# Altium schematic sheet Sheet1.SchDoc
size D
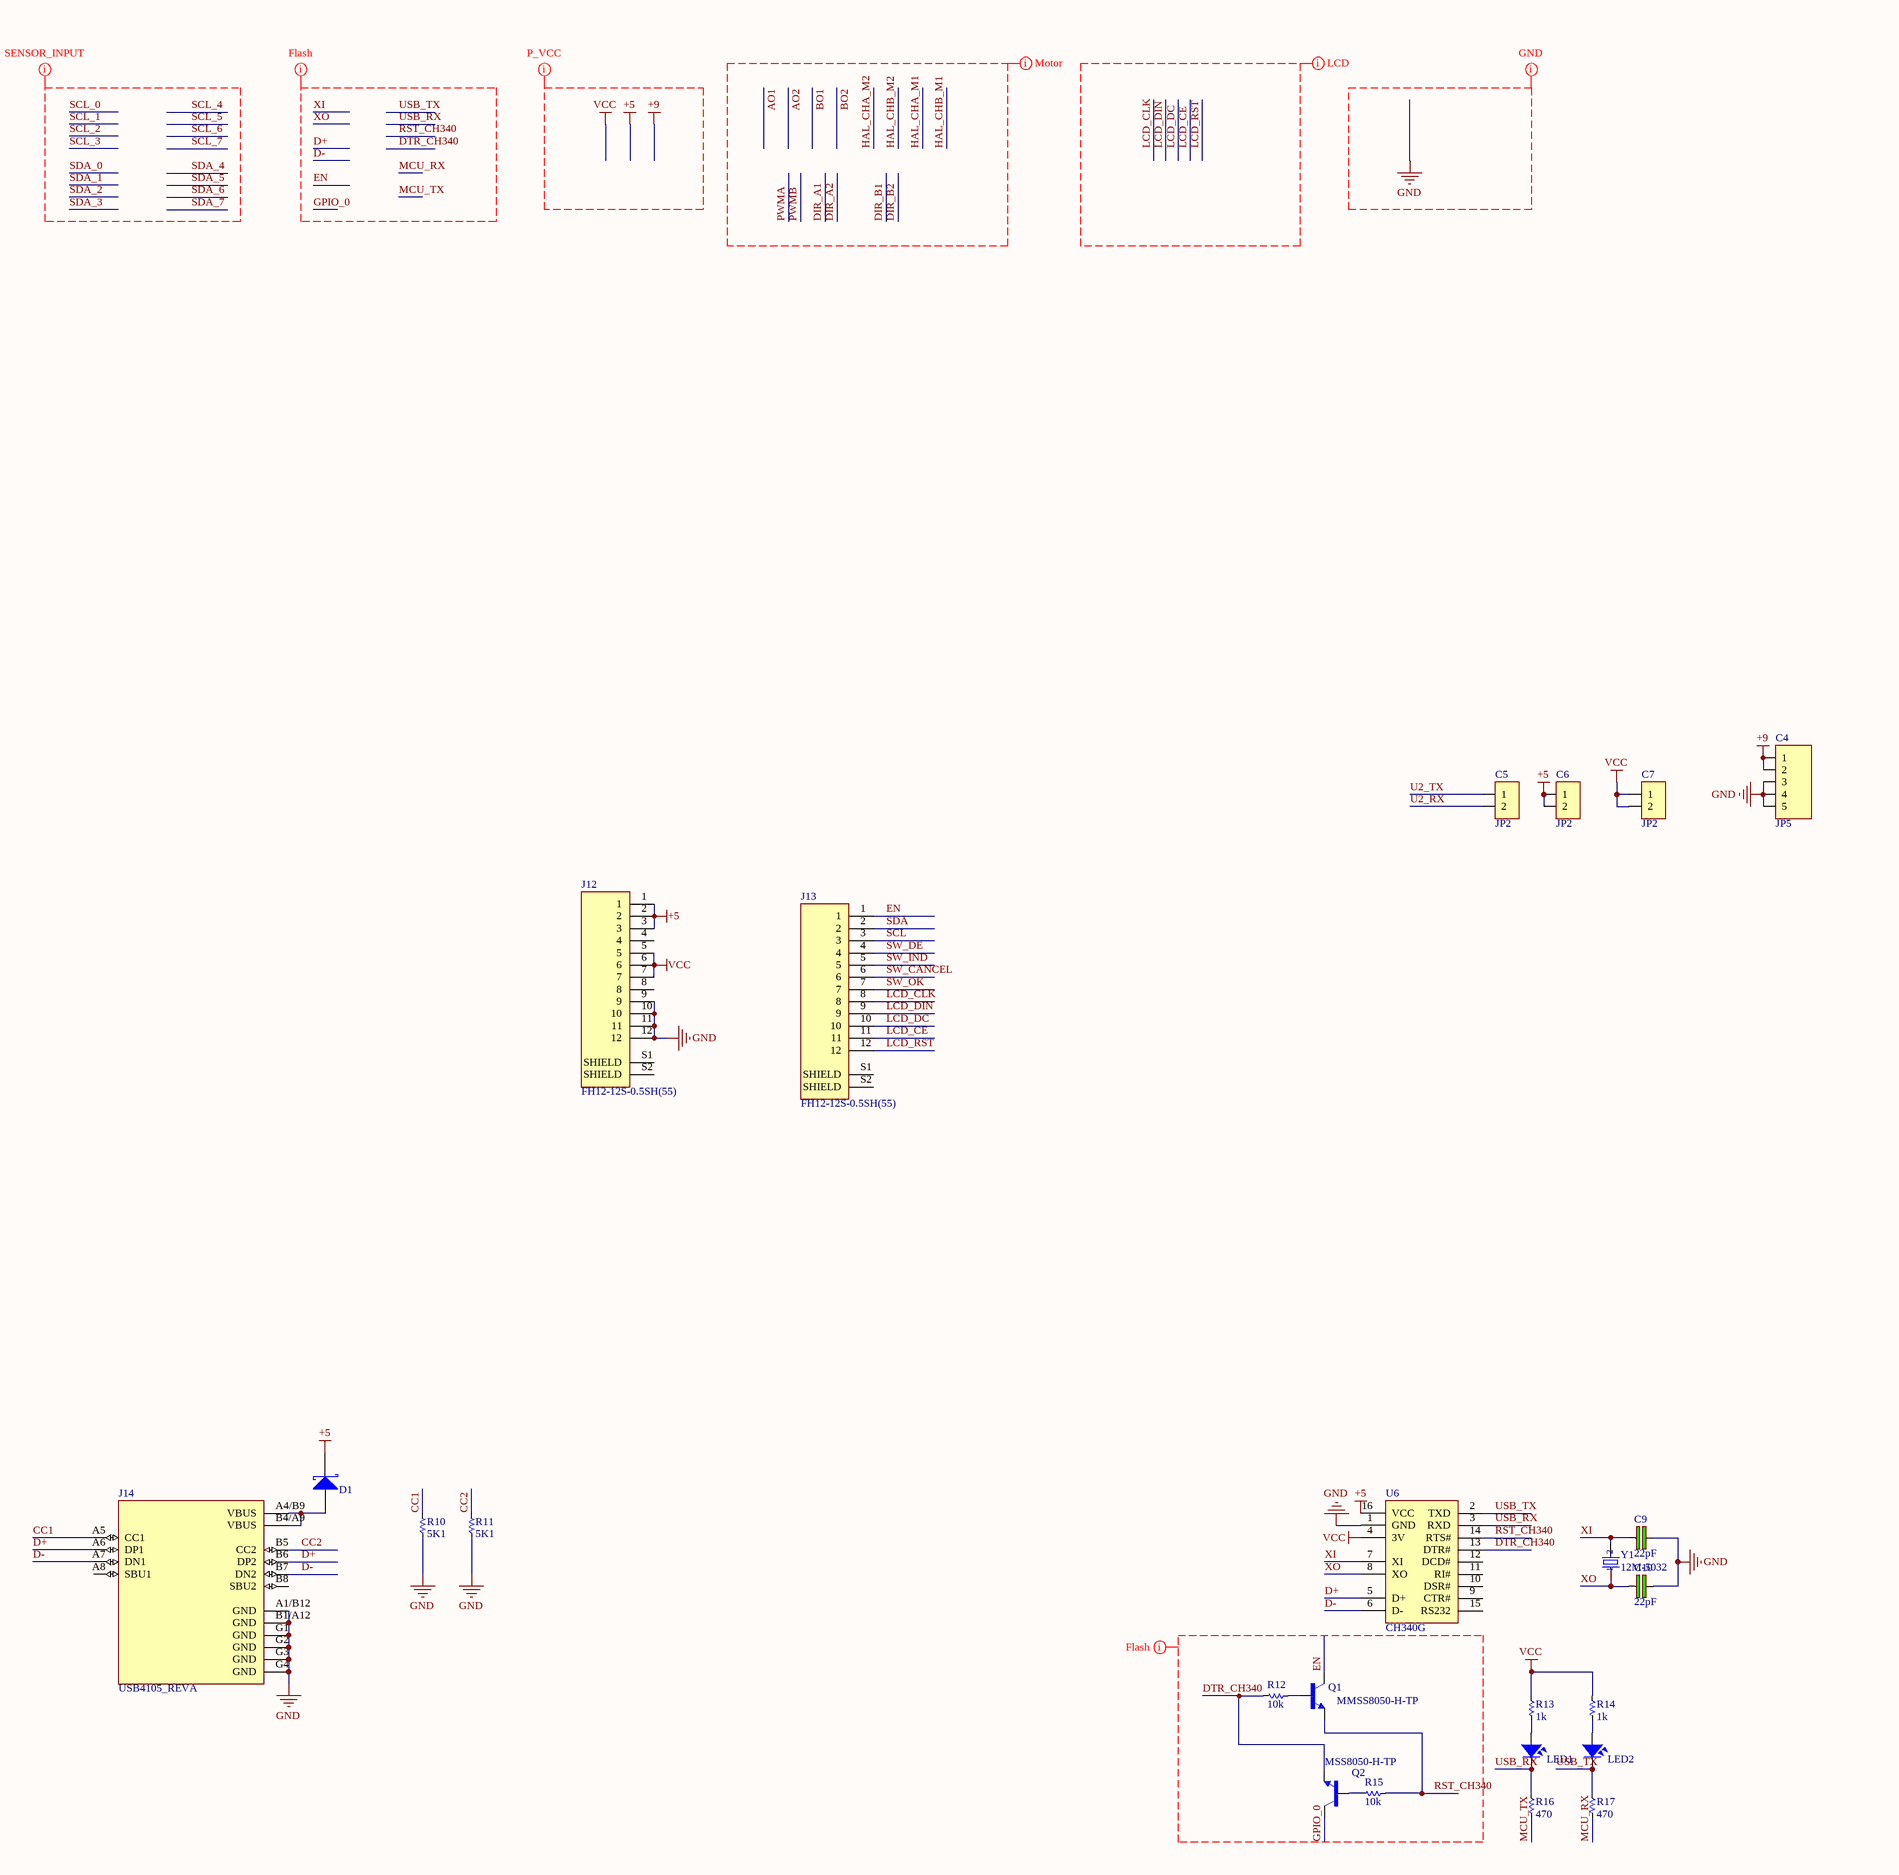
[diagram p0: Sheet1.SchDoc, left]
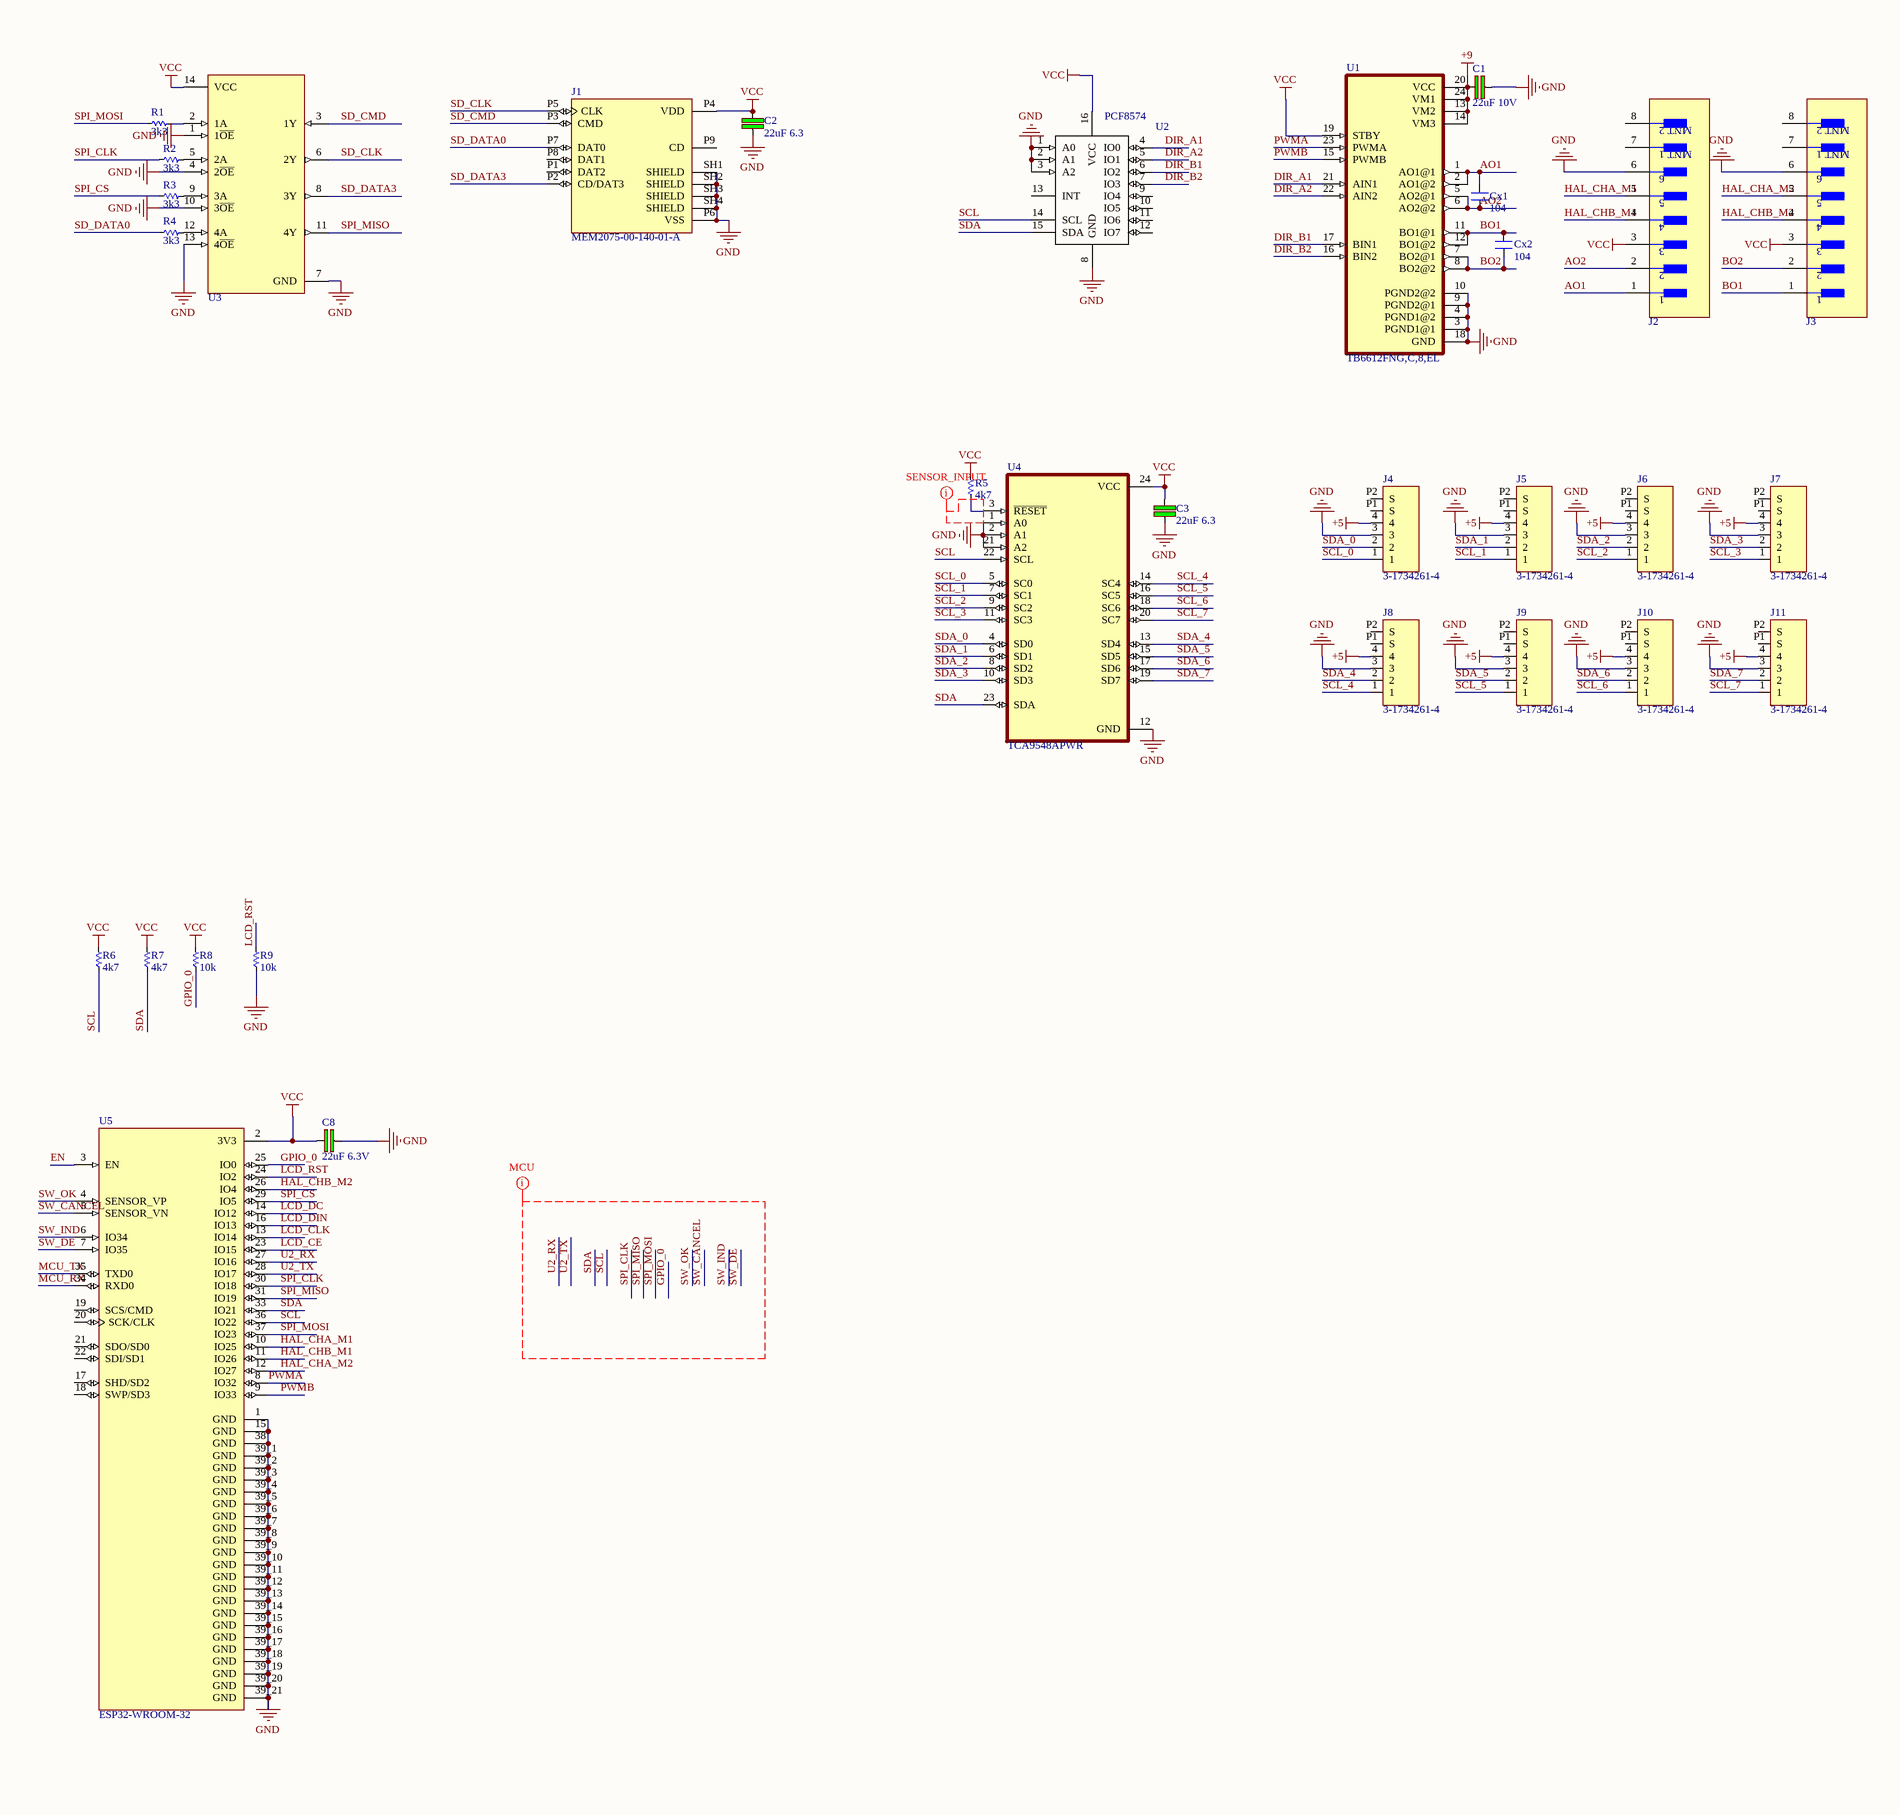
[diagram p1: Sheet1.SchDoc, right]

## Parts
C1  22uF 10V  [CN-SMD-1206]
C2  22uF 6.3  [CN-SMD-1206]
C3  22uF 6.3  [CN-SMD-1206]
C4  JP5  [JP5-D1T]
C5  JP2  [JP2-D1T]
C6  JP2  [JP2-D1T]
C7  JP2  [JP2-D1T]
C8  22uF 6.3V  [CN-SMD-1206]
C9  22pF  [CN-SMD-0603]
C10  22pF  [CN-SMD-0603]
Cx1  104  [CN-SMD-0603]
Cx2  104  [CN-SMD-0603]
D1  D Schottky  [SS34]  (value not drawn)
J1  MEM2075-00-140-01-A  [GCT_MEM2075-00-140-01-A]
J2  532610671  [Molex_0_MFG]  (value not drawn)
J3  532610671  [Molex_0_MFG]  (value not drawn)
J4  3-1734261-4  [TE_3-1734261-4]
J5  3-1734261-4  [TE_3-1734261-4]
J6  3-1734261-4  [TE_3-1734261-4]
J7  3-1734261-4  [TE_3-1734261-4]
J8  3-1734261-4  [TE_3-1734261-4]
J9  3-1734261-4  [TE_3-1734261-4]
J10  3-1734261-4  [TE_3-1734261-4]
J11  3-1734261-4  [TE_3-1734261-4]
J12  FH12-12S-0.5SH(55)  [HIROSE_FH12-12S-0.5SH(55)]
J13  FH12-12S-0.5SH(55)  [HIROSE_FH12-12S-0.5SH(55)]
J14  USB4105_REVA  [GCT_USB4105_REVA]
LED1  LED  [LED-0805-Red]  (value not drawn)
LED2  LED  [LED-0805-Red]  (value not drawn)
Q1  MMSS8050-H-TP  [TRANS_MMSS8050-H-TP]
Q2  MSS8050-H-TP  [TRANS_MMSS8050-H-TP]
R1  3k3  [RES-SMD-0603]
R2  3k3  [RES-SMD-0603]
R3  3k3  [RES-SMD-0603]
R4  3k3  [RES-SMD-0603]
R5  4k7  [RES-SMD-0603]
R6  4k7  [RES-SMD-0603]
R7  4k7  [RES-SMD-0603]
R8  10k  [RES-SMD-0603]
R9  10k  [RES-SMD-0603]
R10  5K1  [RES-SMD-0603]
R11  5K1  [RES-SMD-0603]
R12  10k  [RES-SMD-0603]
R13  1k  [RES-SMD-0603]
R14  1k  [RES-SMD-0603]
R15  10k  [RES-SMD-0603]
R16  470  [RES-SMD-0603]
R17  470  [RES-SMD-0603]
U1  TB6612FNG,C,8,EL  [SOP65P760X160-24N]
U2  PCF8574  [SO16L]
U3  SN74HC125PWR  [Texas_Instruments_PW0014A_MFG]  (value not drawn)
U4  TCA9548APWR  [SOP65P640X120-24N]
U5  ESP32-WROOM-32  [MODULE_ESP32-WROOM-32]
U6  CH340G  [SO16]
Y1  12M-5032  [X2-SMD-5.0X3.2X1.3MM]

## Nets
+5: C6.1 C6.2 D1.2(K) J4.4 J5.4 J6.4 J7.4 J8.4 J9.4 J10.4 J11.4 J12.1 J12.2 J12.3 U6.16(VCC)
+9: C1.2 C4.1 C4.2 U1.13(VM2) U1.14(VM3) U1.20(VCC) U1.24(VM1)
GND: C1.1 C2.1 C3.1 C4.3 C4.4 C4.5 C8.1 C9.2 C10.2 J1.P6(VSS) J1.SH1(SHIELD) J1.SH2(SHIELD) J1.SH3(SHIELD) J1.SH4(SHIELD) J2.6 J3.6 J4.3 J5.3 J6.3 J7.3 J8.3 J9.3 J10.3 J11.3 J12.9 J12.10 J12.11 J12.12 J14.A1/B12(GND) J14.B1/A12(GND) J14.G1(GND) J14.G2(GND) J14.G3(GND) J14.G4(GND) R9.1 R10.1 R11.1 U1.3(PGND1@1) U1.4(PGND1@2) U1.9(PGND2@1) U1.10(PGND2@2) U1.18(GND) U2.1(A0) U2.2(A1) U2.3(A2) U2.8(GND) U3.1(1~{OE}) U3.4(2~{OE}) U3.7(GND) U3.10(3~{OE}) U3.13(4~{OE}) U4.1(A0) U4.2(A1) U4.12(GND) U4.21(A2) U5.1(GND) U5.15(GND) U5.38(GND) U5.39_1(GND) U5.39_2(GND) U5.39_3(GND) U5.39_4(GND) U5.39_5(GND) U5.39_6(GND) U5.39_7(GND) U5.39_8(GND) U5.39_9(GND) U5.39_10(GND) U5.39_11(GND) U5.39_12(GND) U5.39_13(GND) U5.39_14(GND) U5.39_15(GND) U5.39_16(GND) U5.39_17(GND) U5.39_18(GND) U5.39_19(GND) U5.39_20(GND) U5.39_21(GND) U6.1(GND)
VCC: C2.2 C3.2 C7.1 C7.2 C8.2 J1.P4(VDD) J2.3 J3.3 J12.5 J12.6 J12.7 R5.2 R6.2 R7.2 R8.2 R13.2 R14.2 U1.19(STBY) U2.16(VCC) U3.14(VCC) U4.24(VCC) U5.2(3V3) U6.4(3V)
AO1: Cx1.2 J2.1 U1.1(AO1@1) U1.2(AO1@2)
AO2: Cx1.1 J2.2 U1.5(AO2@1) U1.6(AO2@2)
BO1: Cx2.2 J3.1 U1.11(BO1@1) U1.12(BO1@2)
BO2: Cx2.1 J3.2 U1.7(BO2@1) U1.8(BO2@2)
CC1: J14.A5(CC1) R10.2
CC2: J14.B5(CC2) R11.2
D+: J14.A6(DP1) J14.B6(DP2) U6.5(D+)
D-: J14.A7(DN1) J14.B7(DN2) U6.6(D-)
DIR_A1: U1.21(AIN1) U2.4(IO0)
DIR_A2: U1.22(AIN2) U2.5(IO1)
DIR_B1: U1.17(BIN1) U2.6(IO2)
DIR_B2: U1.16(BIN2) U2.7(IO3)
DTR_CH340: Q2.2(E) R12.1 U6.13(DTR#)
EN: J13.1 Q1.3(C) U5.3(EN)
GPIO_0: Q2.3(C) R8.1 U5.25(IO0)
HAL_CHA_M1: J2.5 U5.10(IO25)
HAL_CHA_M2: J3.5 U5.12(IO27)
HAL_CHB_M1: J2.4 U5.11(IO26)
HAL_CHB_M2: J3.4 U5.26(IO4)
LCD_CE: J13.11 U5.23(IO15)
LCD_CLK: J13.8 U5.13(IO14)
LCD_DC: J13.10 U5.14(IO12)
LCD_DIN: J13.9 U5.16(IO13)
LCD_RST: J13.12 R9.2 U5.24(IO2)
MCU_RX: R17.1 U5.34(RXD0)
MCU_TX: R16.1 U5.35(TXD0)
PWMA: U1.23(PWMA) U5.8(IO32)
PWMB: U1.15(PWMB) U5.9(IO33)
RST_CH340: Q1.2(E) R15.2 U6.14(RTS#)
SCL: J13.3 R6.1 U2.14(SCL) U4.22(SCL) U5.36(IO22)
SCL_0: J4.1 U4.5(SC0)
SCL_1: J5.1 U4.7(SC1)
SCL_2: J6.1 U4.9(SC2)
SCL_3: J7.1 U4.11(SC3)
SCL_4: J8.1 U4.14(SC4)
SCL_5: J9.1 U4.16(SC5)
SCL_6: J10.1 U4.18(SC6)
SCL_7: J11.1 U4.20(SC7)
SD_CLK: J1.P5(CLK) U3.6(2Y)
SD_CMD: J1.P3(CMD) U3.3(1Y)
SD_DATA0: J1.P7(DAT0) R4.2
SD_DATA3: J1.P2(CD/DAT3) U3.8(3Y)
SDA: J13.2 R7.1 U2.15(SDA) U4.23(SDA) U5.33(IO21)
SDA_0: J4.2 U4.4(SD0)
SDA_1: J5.2 U4.6(SD1)
SDA_2: J6.2 U4.8(SD2)
SDA_3: J7.2 U4.10(SD3)
SDA_4: J8.2 U4.13(SD4)
SDA_5: J9.2 U4.15(SD5)
SDA_6: J10.2 U4.17(SD6)
SDA_7: J11.2 U4.19(SD7)
SPI_CLK: R2.2 U5.30(IO18)
SPI_CS: R3.2 U5.29(IO5)
SPI_MISO: U3.11(4Y) U5.31(IO19)
SPI_MOSI: R1.2 U5.37(IO23)
SW_CANCEL: J13.6 U5.5(SENSOR_VN)
SW_DE: J13.4 U5.7(IO35)
SW_IND: J13.5 U5.6(IO34)
SW_OK: J13.7 U5.4(SENSOR_VP)
U2_RX: C5.2 U5.27(IO16)
U2_TX: C5.1 U5.28(IO17)
USB_RX: LED1.2 R16.2 U6.3(RXD)
USB_TX: LED2.2 R17.2 U6.2(TXD)
XI: C9.1 U6.7(XI) Y1.2
XO: C10.1 U6.8(XO) Y1.1
NetD1_1: D1.1(A) J14.A4/B9(VBUS) J14.B4/A9(VBUS)
NetLED1_1: LED1.1 R13.1
NetLED2_1: LED2.1 R14.1
NetQ1_1: Q1.1(B) R12.2
NetQ2_1: Q2.1(B) R15.1
NetR1_1: R1.1 U3.2(1A)
NetR2_1: R2.1 U3.5(2A)
NetR3_1: R3.1 U3.9(3A)
NetR4_1: R4.1 U3.12(4A)
NetR5_1: R5.1 U4.3(~{RESET})

Not connected (* = marked no-connect by the designer): J1 P1(DAT2) P8(DAT1) P9(CD); J2 7(MNT_1) 8(MNT_2); J3 7(MNT_1) 8(MNT_2); J4 P1(S) P2(S); J5 P1(S) P2(S); J6 P1(S) P2(S); J7 P1(S) P2(S); J8 P1(S) P2(S); J9 P1(S) P2(S); J10 P1(S) P2(S); J11 P1(S) P2(S); J12 4 8 S1(SHIELD) S2(SHIELD); J13 S1(SHIELD) S2(SHIELD); J14 A8(SBU1) B8(SBU2); U2 9(IO4) 10(IO5) 11(IO6) 12(IO7) 13(INT); U5 17(SHD/SD2) 18(SWP/SD3) 19(SCS/CMD) 20(SCK/CLK) 21(SDO/SD0) 22(SDI/SD1); U6 9(CTR#) 10(DSR#) 11(RI#) 12(DCD#) 15(RS232)

## Layout directives
net class SENSOR_INPUT: (no net found under the mark), SCL_0, SCL_1, SCL_2, SCL_3, SCL_4, SCL_5, SCL_6, SCL_7, SDA_0, SDA_1, SDA_2, SDA_3, SDA_4, SDA_5, SDA_6, SDA_7
net class Flash: D+, D-, DTR_CH340, EN, GPIO_0, MCU_RX, MCU_TX, RST_CH340, USB_RX, USB_TX, XI, XO
net class P_VCC: +5, +9, VCC
net class Motor: AO1, AO2, BO1, BO2, DIR_A1, DIR_A2, DIR_B1, DIR_B2, HAL_CHA_M1, HAL_CHA_M2, HAL_CHB_M1, HAL_CHB_M2, PWMA, PWMB
net class MCU: GPIO_0, SCL, SDA, SPI_CLK, SPI_MISO, SPI_MOSI, SW_CANCEL, SW_DE, SW_IND, SW_OK, U2_RX, U2_TX
net class LCD: LCD_CE, LCD_CLK, LCD_DC, LCD_DIN, LCD_RST
net class GND: GND

## Library data of the parts
C1-C3 C8 = C: Cap SMD 1206 >5V; Value: 103
C4 = JP5: WR-PHD 2.54 mm Angled Socket Header; Manufacturer: W¨¹rth Elektronik eiSos GmbH; partNo: 613005143121; ComponentLink1 Description: Manufacturer; ComponentLink2 Description: Datasheet; NoPins: 05; Created Date: 29 March 2013; ComponentLink1URL: http://www.we-online.com; ComponentLink2URL: http://katalog.we-online.de/em/datasheet/6130xx143121.pdf; Created by: Karrer Zheng
C5-C7 = JP2: WR-PHD 2.54 mm Angled Socket Header; Manufacturer: W¨¹rth Elektronik eiSos GmbH; partNo: 613002143121; ComponentLink1 Description: Manufacturer; ComponentLink2 Description: Datasheet; NoPins: 02; Created Date: 29 March 2013; ComponentLink1URL: http://www.we-online.com; ComponentLink2URL: http://katalog.we-online.de/em/datasheet/6130xx143121.pdf; Created by: Karrer Zheng
C9 C10 = C: Cap SMD; Value: 103
Cx1 Cx2 = CN: Value: 33pF
D1 = D Schottky: Schottky Diode; Published: 8-Jun-2000; LatestRevisionDate: 17-Jul-2002; LatestRevisionNote: Re-released for DXP Platform.; PackageReference: SMB; Publisher: Altium Limited; PackageDescription: DO-214-AA/SMB; 2 C-Bend Leads; Body 5.3 x 3.6 mm, inc. leads (LxW); Code_JEDEC: DO-214-AA
J1 = MEM2075-00-140-01-A: 9 _8 + 1_ Position Card Connector microSDâ„¢ Surface Mount, Right Angle Gold; MF: Global Connector Technology; Availability: Unavailable; Price: None; SnapEDA_Link: https://www.snapeda.com/parts/MEM2075-00-140-01-A/Global%20Connector%20Technology/view-part/2680480/?ref=snap; Value: *; Package: Package Analog Devices; MP: MEM2075-00-140-01-A
J4-J11 = 3-1734261-4: 4ä½å•æŽ’1.25mmç›´è§’è¡¨é¢å®‰è£…æŽ¥å¤´è¿žæŽ¥å™¨; MF: TE Connectivity; Price: None; MP: 3-1734261-4; SnapEDA_Link: https://www.snapeda.com/parts/3-1734261-4/TE%20Connectivity%20AMP%20Connectors/view-part/1366391/?ref=snap; EU_RoHS_Compliance: Compliant; Package: None; Availability: Unavailable; Value: *
J12 J13 = FH12-12S-0.5SH(55): 12 Position FFC, FPC Connector Contacts, Bottom 0.020 _0.50mm_ Surface Mount, Right Angle; MF: Hirose; MP: FH12-12S-0.5SH_55_; Availability: Unavailable; Price: None; Package: None; Value: *; SnapEDA_Link: https://www.snapeda.com/parts/FH12-12S-0.5SH%2855%29/Hirose%20Electric%20Co%20Ltd/view-part/110249/?ref=snap
J14 = USB4105_REVA: USB-C _USB TYPE-C_ USB 2.0 Receptacle Connector 24 _16+8 Dummy_ Position Surface Mount, Right Angle; Through Hole; MF: Global Connector Technology; SnapEDA_Link: https://www.snapeda.com/parts/USB4105/Global%20Connector%20Technology/view-part/4223080/?ref=snap; Value: *; Price: None; Availability: Unavailable; MP: USB4105; Package: Package Analog Devices
LED1 LED2 = LED SMD: Value: LED 3 - 5 ly 2 Colour
Q1 Q2 = MMSS8050-H-TP: Bipolar _BJT_ Transistor NPN 25V 1.5A 100MHz 625mW Surface Mount SOT-23; MF: Micro Commercial; Value: *; Availability: Unavailable; SnapEDA_Link: https://www.snapeda.com/parts/MMSS8050-H-TP/Micro%20Commercial/view-part/423878/?ref=snap; Package: SOT-23 Micro Commercial; MP: MMSS8050-H-TP; Price: None
R1-R17 = Res-SMD: Resistor; Manufacturer: Generic Components; Class: Passive; Published: 08/06/2000; Publisher: Altium Hobart Technology Centre
U1 = TB6612FNG,C,8,EL: Motor Driver Power MOSFET Parallel 24-SSOP; MF: Toshiba; Digi-Key_Part_Number: TB6612FNGC8ELCT-ND; MP: TB6612FNG,C,8,EL; Value: *; SnapEDA_Link: https://www.snapeda.com/parts/TB6612FNG%2CC%2C8%2CEL/Toshiba%20Semiconductor%20and%20Storage/view-part/424445/?ref=snap; Digi-Key_Purchase_URL: https://www.digikey.com/product-detail/en/toshiba-semiconductor-and-storage/TB6612FNG,C,8,EL/TB6612FNGC8ELCT-ND/1730134?utm_source=snapeda&utm_medium=aggregator&utm_campaign=symbol; Package: SSOP-24 Toshiba
U2 = PCF8574: I2C PORT EXPANDER; Manufacturer Part Number: PCF8574T/3,512; Manufacturer: NXP Semiconductors; Includes: POR; Interface: I²C; Interrupt Output: Yes; Number of I /O: 8; Voltage - Supply: 2.5 V ~ 6 V; Frequency - Clock: 100KHz; Supplier 1: Digi-Key; Supplier Part Number 1: 568-1076-5-ND; Package / Case: 16-SOIC (7.5mm Width); Category: Integrated Circuits (ICs); Supplier Part Number: 568-1076-5-ND; Operating Temperature: -40°C ~ 85°C; Packaging: Tube; RoHS: RoHS Compliant; Supplier: Digi-Key
U4 = TCA9548APWR: Low-Voltage 8-Channel I2C Switch With Reset; MF: Texas Instruments; MP: TCA9548APWR; Price: None; DigiKey-Purchase-URL: https://snapeda.com/shop?store=DigiKey&id=280817; Package: TSSOP-24 Texas Instruments; Mouser-Purchase-URL: https://snapeda.com/shop?store=Mouser&id=280817; Texas_Instruments-Purchase-URL: https://snapeda.com/shop?store=Texas+Instruments&id=280817; Value: *; Availability: Unavailable; Arrow_Electronics-Purchase-URL: https://snapeda.com/shop?store=Arrow+Electronics&id=280817; SnapEDA_Link: https://www.snapeda.com/parts/TCA9548APWR/Texas%20Instruments/view-part/280817/?ref=snap
U5 = ESP32-WROOM-32: Bluetooth, WiFi Transceiver Module 2.4GHz ~ 2.5GHz Surface Mount; MF: Espressif Systems; Package: Module Espressif Systems; Digi-Key_Part_Number: 1904-1010-1-ND; Digi-Key_Purchase_URL: https://www.digikey.com/product-detail/en/espressif-systems/ESP32-WROOM-32/1904-1010-1-ND/8544305?utm_source=snapeda&utm_medium=aggregator&utm_campaign=symbol; Value: *; MP: ESP32-WROOM-32; SnapEDA_Link: https://www.snapeda.com/parts/ESP32-WROOM-32/Espressif%20Systems/view-part/2753322/?ref=snap
U6 = CH340G: High and Low Side Driver; Note: Pins 4, 8 and 14 are not connected; Published: 8-Jun-2000; LatestRevisionDate: 04-Mar-2005; LatestRevisionNote: Stylized 3D Model Added.; DatasheetVersion: PD60147J; PackageReference: PDIP14; Publisher: Altium Limited; PackageDescription: DIP; 14 Leads; Row Spacing 7.62 mm; Pitch 2.54 mm; ComponentLink1Description: Manufacturer Link; ComponentLink1URL: http://www.irf.com/; ComponentLink2Description: Datasheet; ComponentLink2URL: http://www.irf.com/product-info/datasheets/data/ir2110.pdf
Y1 = SMD-CRYSTAL-8MHZ-20PF-20PPM(2P-5.0X3.2MM): SMD Crystal 8MHz-20pF-20ppm;; MF: Xinhunjing; MP: 5032/4P; Price: None; Availability: Unavailable; Package: None; SnapEDA_Link: https://www.snapeda.com/parts/5032/4P/Xinhunjing/view-part/105660/?ref=snap; Value: *